# EAGLE design USB_PC (EAGLE 9.0.0)
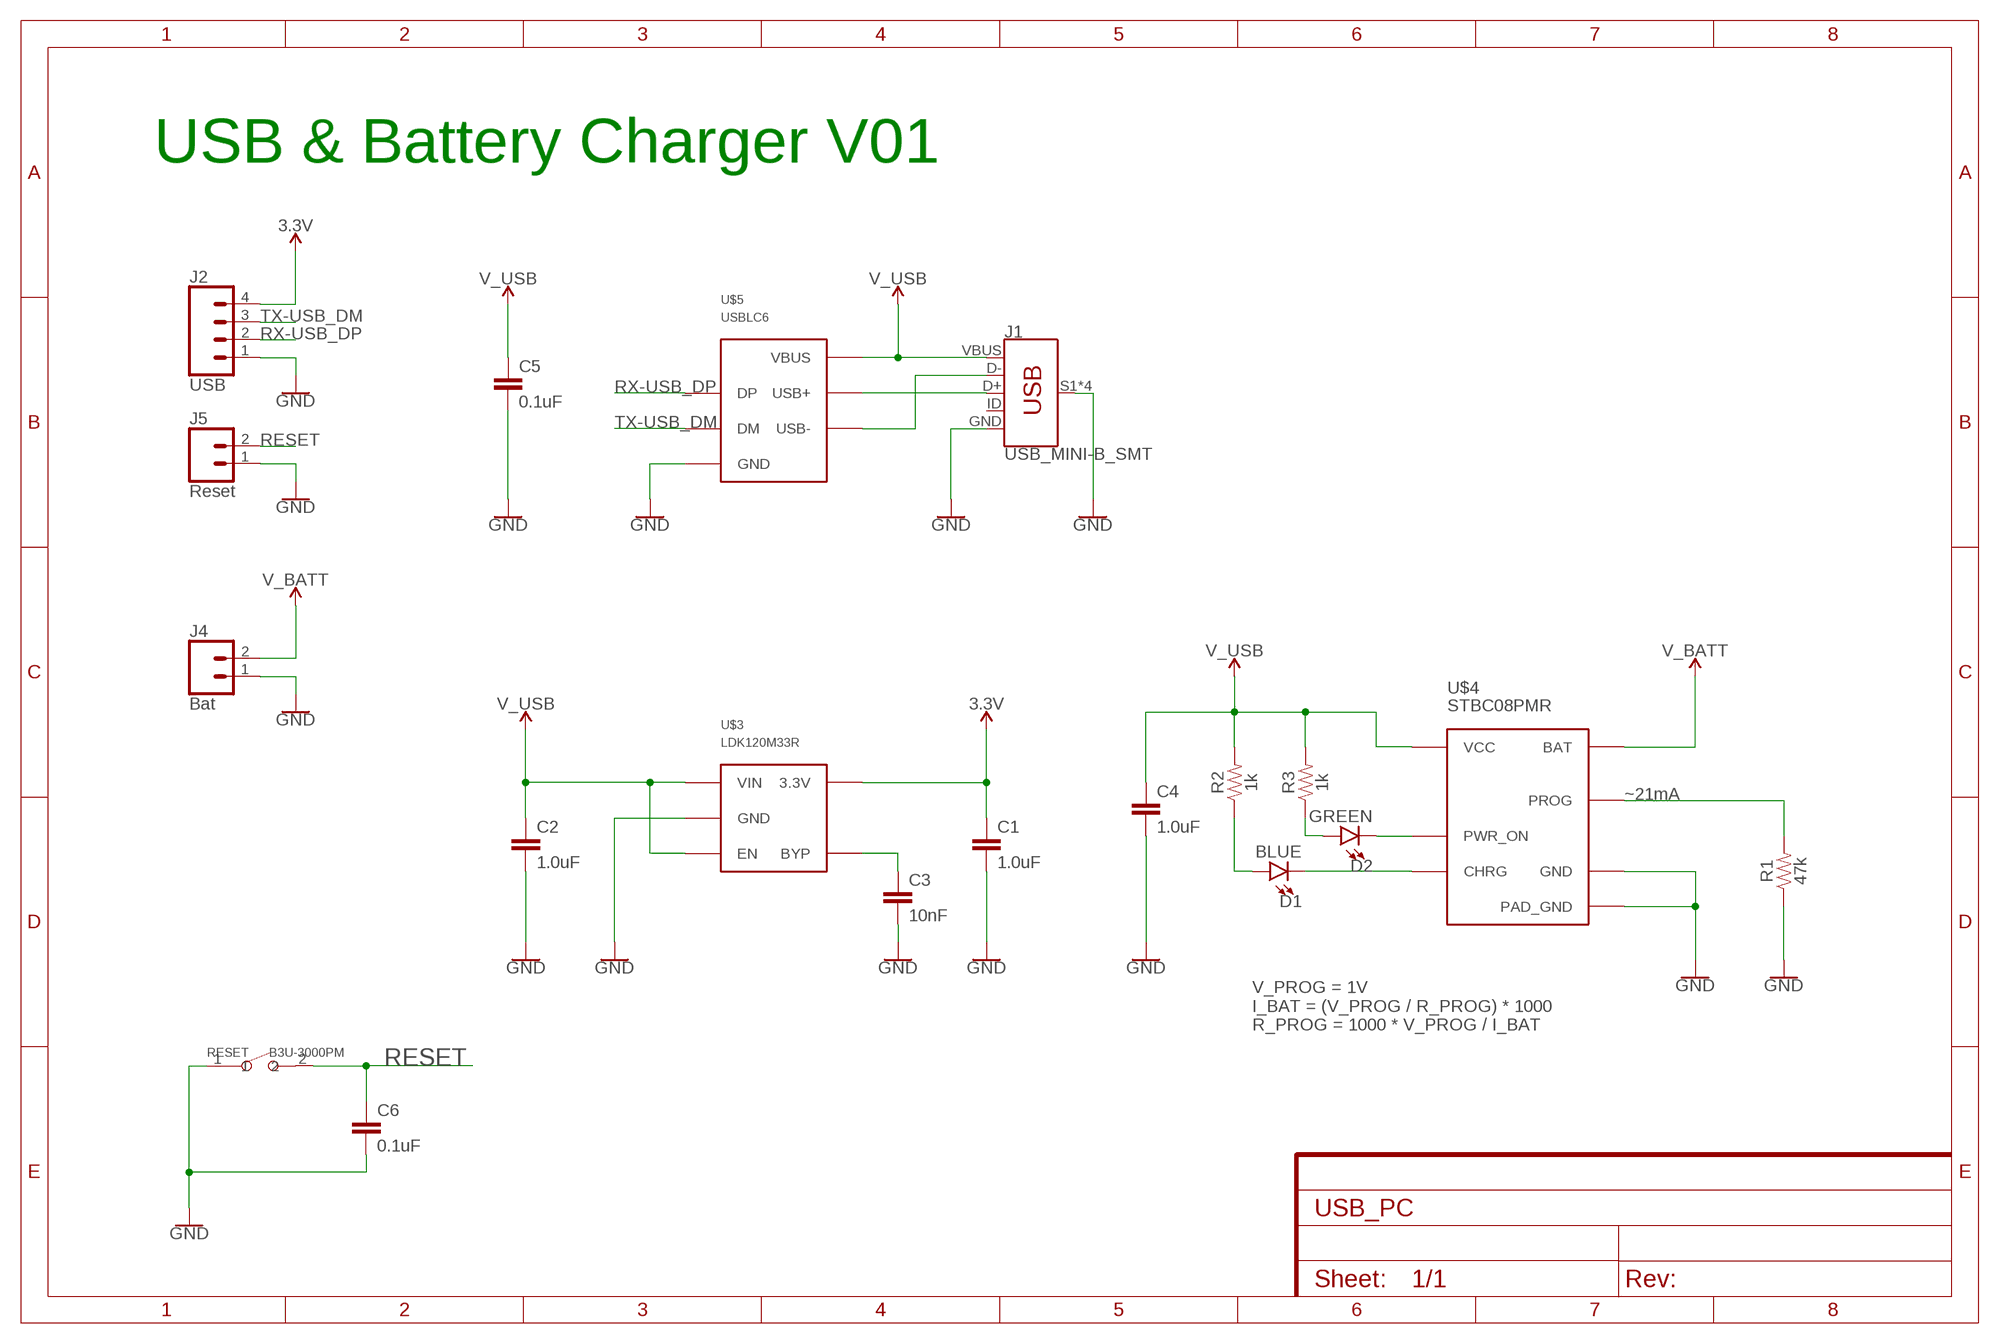
[diagram p0: schematic, sheet 1]

## Parts
C1  1.0uF  1.0UF-0603-16V-10%  [0603]
C2  1.0uF  1.0UF-0603-16V-10%  [0603]
C3  10nF  10NF-0603-50V-10%  [0603]
C4  1.0uF  1.0UF-0603-16V-10%  [0603]
C5  0.1uF  0.1UF-0603-25V-5%  [0603]
C6  0.1uF  0.1UF-0603-25V-5%  [0603]
D1  BLUE  LED-BLUE0603  [LED-0603]
D2  GREEN  LED-GREEN0603  [LED-0603]
J1  USB_MINI-B_SMT  [USB-MINIB]
J2  USB  CONN_04  [1X04]
J4  Bat  CONN_02JST-PTH-2  [JST-2-PTH]
J5  Reset  CONN_02  [1X02]
R1  47k  47KOHM-0603-1/10W-1%  [0603]
R2  1k  1KOHM-0603-1/10W-1%  [0603]
R3  1k  1KOHM-0603-1/10W-1%  [0603]
RESET  B3U-3000PM  SMD-BUTTON(2P-3.0X2.5X1.2+0.4MM)-B3U-1000P-2P-SMD  [SW2-2.6-3.0X2.5X1.2+0.4MM]
U$3  LDK120M33R  [SOT23-5]
U$4  STBC08PMR  [6-DFN(3X3)]
U$5  USBLC6  USBLC6-2SC6  [SOT23-6L]

## Nets
3.3V: C1.1 J2.4 U$3.3V3&5(3.3V)
GND: C1.2 C2.2 C3.2 C4.2 C5.2 C6.2 J1.GND J1.S1(SHIELD) J1.S2(SHIELD) J1.S3(SHIELD) J1.S4(SHIELD) J2.1 J4.1 J5.1 R1.1 RESET.1 U$3.GND$2(GND) U$4.GND$4(GND) U$4.PAD_GND$7(PAD_GND) U$5.GND$2(GND)
N$1: R1.2 U$4.PROG$5(PROG)
N$2: J1.D+ U$5.D+OUT$1$6(USB+)
N$3: J1.D- U$5.D-OUT$1$4(USB-)
N$4: D2.C U$4.ON$2(PWR_ON)
N$5: D1.C U$4.CHRG$3(CHRG)
N$6: C3.1 U$3.BYP$4(BYP)
N$7: D1.A R2.1
N$8: D2.A R3.1
RESET: C6.1 J5.2 RESET.2
RX-USB_DP: J2.2 U$5.D+IN$1(DP)
TX-USB_DM: J2.3 U$5.D-IN$3(DM)
V_BATT: J4.2 U$4.BAT$1(BAT)
V_USB: C2.1 C4.1 C5.1 J1.VBUS R2.2 R3.2 U$3.EN$3(EN) U$3.VIN$1(VIN) U$4.VCC$6(VCC) U$5.VUSB$5(VBUS)
Unconnected: J1.ID

## Notes on the sheet
- USB & Battery Charger V01
- ~21mA
- V_PROG = 1V
  I_BAT = (V_PROG / R_PROG) * 1000
  R_PROG = 1000 * V_PROG / I_BAT

## Library data of the parts
C1 C2 C4 = SparkFun-Capacitors:1.0UF: 1µF ceramic capacitors A capacitor is a passive two-terminal electrical component used to store electrical energy temporarily in an electric field.; PROD_ID: CAP-00868
C3 = SparkFun-Capacitors:10NF: 0.01uF/10nF/10,000pF ceramic capacitors A capacitor is a passive two-terminal electrical component used to store electrical energy temporarily in an electric field. CAP-09321; PROD_ID: CAP-00867
C5 C6 = SparkFun-Capacitors:0.1UF: 0.1µF ceramic capacitors A capacitor is a passive two-terminal electrical component used to store electrical energy temporarily in an electric field.; PROD_ID: CAP-08604
D1 = SparkFun-LED:LED-BLUE: Blue SMD LED Used in manufacturing of various products at SparkFun Packages: 0603 - SMD 0603 package [Product Link] <http://www.digikey.com/product-detail/en/SMLE12BC7TT86/511-1589-2-ND/1641808> 1206 - SMD1206 package [Product Link] <http://www.digikey.com/product-detail/en/lite-on-inc/LTST-C150TBKT/160-1643-1-ND/573584> SparkFun Products: ESP8266 Thing-Dev Board <https://www.sparkfun.com/products/13711> RedBoard <https://www.sparkfun.com/products/12757>; PROD_ID: DIO-08575
D2 = SparkFun-LED:LED-GREEN: Green SMD LED Used in manufacturing of various products at SparkFun Packages: 0603 - SMD 0603 package [Product Link] <http://www.futureelectronics.com/en/technologies/semiconductors/optoelectronics/leds/Pages/9894312-LTST-C190GKT.aspx?CrossPart=HSMG-C190&IM=0> LilyPad 1206 - SMD1206 LilyPad package [Product Link] <http://www.futureelectronics.com/en/Technologies/Product.aspx?ProductID=IN150NGHARVATEKCORPORATION2049943&IM=0> 1206 - SMD1206 package [Product Link] <http://www.futureelectronics.com/en/technologies/semiconductors/optoelectronics/leds/Pages/8315665-LTST-C150KGKT.aspx?IM=0> 1206 Bottom Mount -SMD 1206 Bottom Mount [Product Link] <http://www.digikey.com/product-detail/en/lite-on-inc/LTST-C230KGKT/160-1456-1-ND/386854> SparkFun Products: Pro Mini 328 -5V <https://www.sparkfun.com/products/821> RedBoard <https://www.sparkfun.com/products/12757> MP3 Trigger <https://www.sparkfun.com/products/13720> Makey Makey <https://www.sparkfun.com/products/11076>; PROD_ID: DIO-00821
J1 = SparkFun-Connectors:USB_MINI-B: USB type Mini-B Connector Breaks out 5th pin, and includes shield pins if needed. SparkFun Products: SparkFun FTDI Basic Breakout <https://www.sparkfun.com/products/9716> SparkFun XBee Explorer USB <https://www.sparkfun.com/products/11812> SparkFun Redboard <https://www.sparkfun.com/products/12757>; PROD_ID: CONN-08193; SF_ID: PRT-00587
J2 = SparkFun-Connectors:CONN_04: Multi connection point. Often used as Generic Header-pin footprint for 0.1 inch spaced/style header connections On any of the 0.1 inch spaced packages, you can populate with these: Break Away Headers - Straight <https://www.sparkfun.com/products/116> (PRT-00116) Break Away Male Headers - Right Angle <https://www.sparkfun.com/products/553> (PRT-00553) Female Headers <https://www.sparkfun.com/products/115> (PRT-00115) Break Away Headers - Machine Pin <https://www.sparkfun.com/products/117> (PRT-00117) Break Away Female Headers - Swiss Machine Pin <https://www.sparkfun.com/products/743> (PRT-00743) For SCREWTERMINALS and SPRING TERMINALS visit here: Screw Terimnals on SparkFun.com <https://www.sparkfun.com/search/results?term=Screw+Terminals> (5mm/3.5mm/2.54mm spacing) This device is also useful as a general connection point to wire up your design to another part of your project. Our various solder wires solder well into these plated through hole pads. Hook-Up Wire - Assortment (Stranded, 22 AWG) <https://www.sparkfun.com/products/11375> (PRT-11375) Hook-Up Wire - Assortment (Solid Core, 22 AWG) <https://www.sparkfun.com/products/11367> (PRT-11367) View the entire wire category on our website here <https://www.sparkfun.com/categories/141> Special notes: Molex polarized connector foot print use with SKU : PRT-08231 with associated crimp pins and housings. 1MM SMD Version SKU: PRT-10208; PROD_ID: CONN-09696
J4 = SparkFun-Connectors:CONN_02: Multi connection point. Often used as Generic Header-pin footprint for 0.1 inch spaced/style header connections On any of the 0.1 inch spaced packages, you can populate with these: Break Away Headers - Straight <https://www.sparkfun.com/products/116> (PRT-00116) Break Away Male Headers - Right Angle <https://www.sparkfun.com/products/553> (PRT-00553) Female Headers <https://www.sparkfun.com/products/115> (PRT-00115) Break Away Headers - Machine Pin <https://www.sparkfun.com/products/117> (PRT-00117) Break Away Female Headers - Swiss Machine Pin <https://www.sparkfun.com/products/743> (PRT-00743) For SCREWTERMINALS and SPRING TERMINALS visit here: Screw Terimnals on SparkFun.com <https://www.sparkfun.com/search/results?term=Screw+Terminals> (5mm/3.5mm/2.54mm spacing) This device is also useful as a general connection point to wire up your design to another part of your project. Our various solder wires solder well into these plated through hole pads. Hook-Up Wire - Assortment (Stranded, 22 AWG) <https://www.sparkfun.com/products/11375> (PRT-11375) Hook-Up Wire - Assortment (Solid Core, 22 AWG) <https://www.sparkfun.com/products/11367> (PRT-11367) View the entire wire category on our website here <https://www.sparkfun.com/categories/141> Special notes: Molex polarized connector foot print use with: PRT-08233 with associated crimp pins and housings. 2.54_SCREWTERM for use with PRT-10571. 3.5mm Screw Terminal footprints for PRT-08084 5mm Screw Terminal footprints for use with PRT-08432; PROD_ID: CONN-09863; SKU: PRT-09914
J5 = SparkFun-Connectors:CONN_02: Multi connection point. Often used as Generic Header-pin footprint for 0.1 inch spaced/style header connections On any of the 0.1 inch spaced packages, you can populate with these: Break Away Headers - Straight <https://www.sparkfun.com/products/116> (PRT-00116) Break Away Male Headers - Right Angle <https://www.sparkfun.com/products/553> (PRT-00553) Female Headers <https://www.sparkfun.com/products/115> (PRT-00115) Break Away Headers - Machine Pin <https://www.sparkfun.com/products/117> (PRT-00117) Break Away Female Headers - Swiss Machine Pin <https://www.sparkfun.com/products/743> (PRT-00743) For SCREWTERMINALS and SPRING TERMINALS visit here: Screw Terimnals on SparkFun.com <https://www.sparkfun.com/search/results?term=Screw+Terminals> (5mm/3.5mm/2.54mm spacing) This device is also useful as a general connection point to wire up your design to another part of your project. Our various solder wires solder well into these plated through hole pads. Hook-Up Wire - Assortment (Stranded, 22 AWG) <https://www.sparkfun.com/products/11375> (PRT-11375) Hook-Up Wire - Assortment (Solid Core, 22 AWG) <https://www.sparkfun.com/products/11367> (PRT-11367) View the entire wire category on our website here <https://www.sparkfun.com/categories/141> Special notes: Molex polarized connector foot print use with: PRT-08233 with associated crimp pins and housings. 2.54_SCREWTERM for use with PRT-10571. 3.5mm Screw Terminal footprints for PRT-08084 5mm Screw Terminal footprints for use with PRT-08432
R1 = SparkFun-Resistors:47KOHM: 47kΩ resistor A resistor is a passive two-terminal electrical component that implements electrical resistance as a circuit element. Resistors act to reduce current flow, and, at the same time, act to lower voltage levels within circuits. - Wikipedia; PROD_ID: RES-07871
R2 R3 = SparkFun-Resistors:1KOHM: 1kΩ resistor A resistor is a passive two-terminal electrical component that implements electrical resistance as a circuit element. Resistors act to reduce current flow, and, at the same time, act to lower voltage levels within circuits. - Wikipedia; PROD_ID: RES-07856
RESET = Seeed-Switch-2016:SMD-BUTTON(2P-3.0X2.5X1.2+0.4MM): 311020047; MPN: B3U-1000P-2P-SMD; VALUE: B3U-1000P-2P-SMD
U$3 = LDK120M33R:LDK120M33R: TLV733P Capacitor-Free, 300-mA, Low-Dropout Regulator
U$4 = STBC08PMR:STBC08PMR: STBC08PMR Digikey: 497-5808-1-ND
U$5 = USBLC6-2SC6:USBLC6-2SC6: USBLC6-2SC6 Digikey: 497-5235-1-ND

## Board
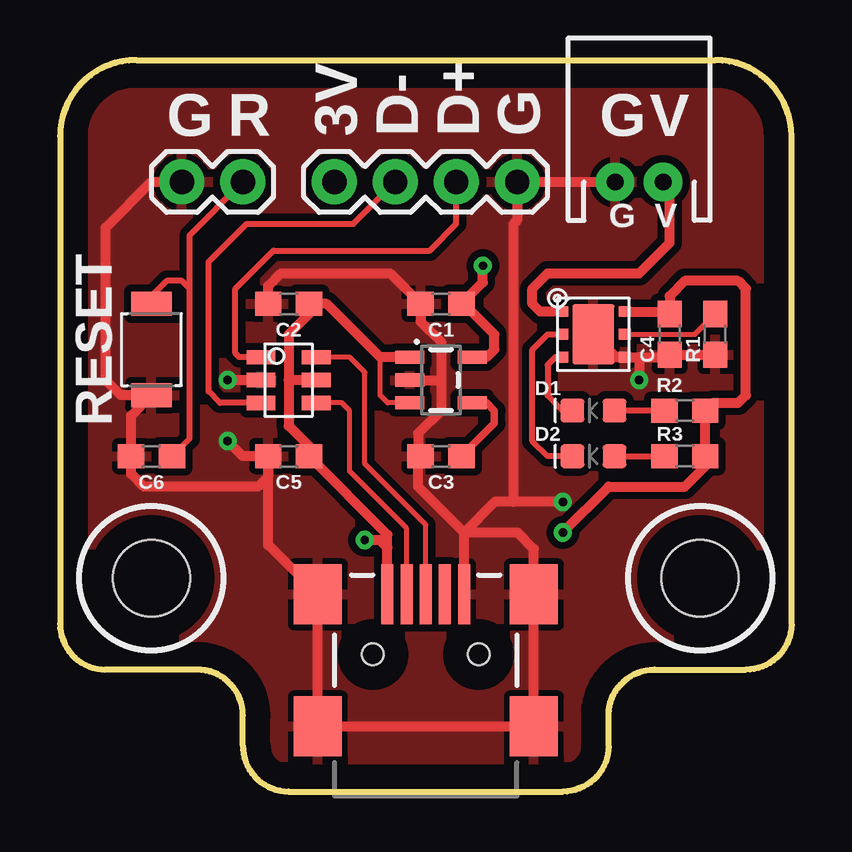
[diagram p1: board, top side]
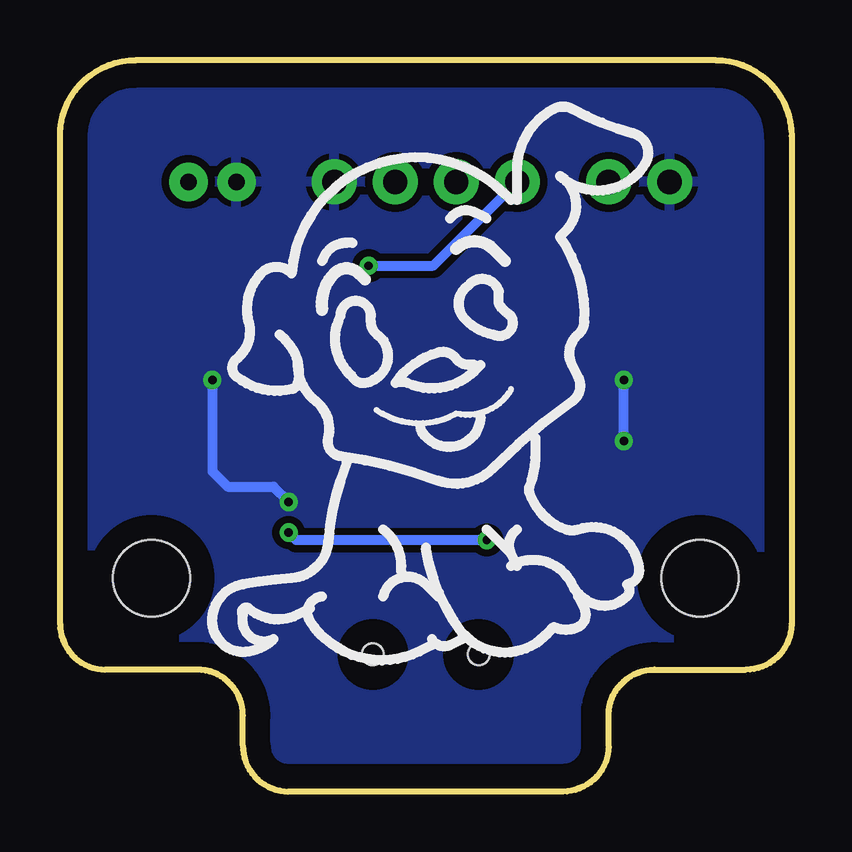
[diagram p2: board, bottom side, seen from below]

Size 30.48 x 30.48 mm. Coordinates in mm from the lower left corner, seen from the top.
Outline: 9.53,0 20.95,0 arc90 22.86,1.91 22.86,3.17 arc-90 24.77,5.08 28.57,5.08 arc90 30.48,6.99 30.48,27.3 arc90 27.3,30.48 3.17,30.48 arc90 0,27.3 0,6.99 arc90 1.91,5.08 5.71,5.08 arc-90 7.62,3.17 7.62,1.91 arc90 9.53,0
Copper layers (1*16): Top 0.035mm / dielectric 1.5mm / Bottom 0.035mm
Design rules "default *": minimum track width 6mil, minimum drill 0.35mm, track to track 6mil, track to pad 6mil, pad to pad 6mil, via to via 6mil, smd to smd 6mil, copper to edge 40mil, drill to drill 6mil, minimum pad ring 10mil, minimum via ring 8mil, stop-mask expansion 4mil, vias tented up to drill 20mil, thermal gap 10mil
Holes 3.2 mm at 26.67,8.89 3.81,8.89

### Footprints (pad centres in the part's own frame; a part is rotated, then mirrored left to right if it is on the bottom)
0603 = smd 1.1 x 1: 1 -0.85,0; 2 0.85,0
LED-0603 = smd 1 x 1: A -0.877,0; C 0.877,0
USB-MINIB = smd 2.5 x 0.5: D+ 2.5,0; D- 2.5,0.8; GND 2.5,-1.6; ID 2.5,-0.8; VBUS 2.5,1.6 | smd 2.5 x 2: S1 -3,4.5; S2 2.5,4.5; S3 -3,-4.5; S4 2.5,-4.5 | hole 0.9: 0,2.2; 0,-2.2
1X04 = drill 1.016 pad 1.88: 1 0,0; 2 2.54,0; 3 5.08,0; 4 7.62,0
JST-2-PTH = drill 0.7 pad 1.6: 1 -1,0; 2 1,0
1X02 = drill 1.016 pad 1.88: 1 0,0; 2 2.54,0
SW2-2.6-3.0X2.5X1.2+0.4MM = smd 1 x 1.7: 1 -1.9,0; 2 1.9,0
SOT23-5 = smd 0.55 x 1.2: 3V3&5 -0.95,1.3; BYP$4 0.95,1.3; EN$3 0.95,-1.3; GND$2 0,-1.3; VIN$1 -0.95,-1.3
6-DFN(3X3) = smd 0.45 x 0.5: BAT$1 -0.95,-1.3; CHRG$3 0.95,-1.3; GND$4 0.95,1.3; ON$2 0,-1.3; PROG$5 0,1.3; VCC$6 -0.95,1.3 | smd 2.5 x 1.75: PAD_GND$7 0,0
SOT23-6L = smd 0.6 x 1.2: D+IN$1 -0.95,-1.15; D+OUT$1$6 -0.95,1.15; D-IN$3 0.95,-1.15; D-OUT$1$4 0.95,1.15; GND$2 0,-1.15; VUSB$5 0,1.15

### Placement (x,y rotation side)
C1  15.88,20.32 180 top
C2  9.53,20.32 180 top
C3  15.88,13.97 180 top
C4  25.4,19.05 270 top
C5  9.53,13.97 180 top
C6  3.81,13.97 180 top
D1  22.23,15.88 180 top
D2  22.23,13.97 180 top
J1  15.24,5.71 90 top
J2  19.05,25.4 180 top
J4  24.13,25.4 0 top
J5  5.08,25.4 0 top
R1  27.3,19.05 90 top
R2  26.04,15.88 0 top
R3  26.04,13.97 0 top
RESET  3.81,18.41 90 top
U$3  15.88,17.14 270 top
U$4  22.23,19.05 270 top
U$5  9.53,17.14 270 top

### Tracks (layer width: path | path; a pad name or v marks a point on that pad's centre or on a via)
3.3V  (via drill 0.35)
  Top 0.406: U$3.3V3&5 17.78,18.1 18.1,18.41 18.1,19.05 16.83,20.32 C1.1 17.62,21.22 v17.62,21.91
  Bottom 0.406: v17.62,21.91 14.92,21.91 J2.4
GND  (via drill 0.35)
  Top 0.406: J1.GND 16.84,10.78 | 16.84,10.78 14.92,12.7 14.92,13.87 14.92,14.92 15.88,15.88 15.88,17.14 | 15.88,17.14 15.88,18.73 15.03,19.58 C1.2 13.76,21.59 9.21,21.59 8.68,21.06 C2.2 | U$3.GND$2 15.88,17.14 | U$5.GND$2 v6.99,17.14 | C5.2 7.62,13.97 v6.99,14.61 | C5.2 8.68,13.12 8.26,12.7 3.49,12.7 2.96,13.23 C6.2 2.96,15.66 RESET.1 2.54,16.52 1.91,17.14 1.91,23.5 3.81,25.4 J5.1 | C5.2 8.68,10.28 J1.S2 J1.S1 J1.S3 J1.S4 19.74,10.11 19.06,10.78 16.84,10.78 | U$4.PAD_GND$7 23.18,18.1 U$4.GND$4 24.13,18.1 | 24.13,18.1 25.3,18.1 C4.2 R1.1 | 24.13,18.1 v24.13,17.14 | v20.95,12.06 18.89,12.06 | 18.89,12.06 18.12,12.06 16.84,10.78 | J4.1 J2.1 19.05,23.81 18.89,23.65 18.89,12.06
  Top 0.508: 14.92,13.87 C3.2
  Bottom 0.406: v6.99,14.61 v6.99,17.14 | v24.13,17.14 24.13,13.34 23.5,12.7 21.59,12.7 v20.95,12.06
  pour Bottom (isolate 0.305): 0,0 30.48,0 30.48,30.48 0,30.48
  pour Top (isolate 0.305): 0,0 30.48,0 30.48,30.48 0,30.48
N$1
  Top 0.203: U$4.PROG$5 26.45,19.05 R1.2
N$2
  Top 0.203: J1.D+ 15.24,11.11 12.7,13.65 12.7,17.46 12.06,18.1 12.06,18.09 U$5.D+OUT$1$6
N$3
  Top 0.203: J1.D- 14.44,10.96 12.06,13.34 12.06,15.88 11.74,16.2 U$5.D-OUT$1$4
N$4
  Top 0.254: D2.C 20.32,13.97 19.68,14.61 19.68,18.41 20.32,19.05 U$4.ON$2
N$5
  Top 0.254: U$4.CHRG$3 20.64,18.1 20.32,17.78 20.32,16.51 20.95,15.88 D1.C
N$6
  Top 0.305: C3.1 18.1,15.34 18.1,15.88 17.78,16.2 U$3.BYP$4
N$7
  Top 0.254: R2.1 D1.A
N$8
  Top 0.254: D2.A R3.1
RESET
  Top 0.254: C6.1 5.4,14.71 5.4,20.95 | 5.4,20.95 5.08,21.27 4.45,21.27 3.81,20.64 RESET.2 | 5.4,20.95 5.4,23.18 J5.2
RX-USB_DP
  Top 0.254: U$5.D+IN$1 7.46,18.09 7.3,18.26 7.3,20.95 8.89,22.54 15.4,22.54 16.51,23.65 J2.2
TX-USB_DM
  Top 0.254: U$5.D-IN$3 6.67,16.2 6.19,16.67 6.19,22.07 7.78,23.65 12.22,23.65 J2.3
V_BATT
  Top 0.406: U$4.BAT$1 20,20 19.68,20.32 19.68,20.95 20.32,21.59 24.13,21.59 25.4,22.86 25.4,25.13 J4.2
V_USB  (via drill 0.35)
  Top 0.203: U$3.EN$3 13.65,16.2 13.34,16.51 13.34,18.1
  Top 0.254: R2.2 27.2,16.19
  Top 0.406: J1.VBUS 13.64,10.16 | 13.64,10.16 13.64,10.71 C5.1 10.38,14.39 9.53,15.24 9.53,17.14 | 9.53,17.14 9.53,19.05 10.38,19.9 C2.1 11.11,20.32 13.34,18.1 U$3.VIN$1 | U$5.VUSB$5 9.53,17.14 | U$4.VCC$6 25.3,20 C4.1 25.4,20.64 26.04,21.27 28.26,21.27 28.57,20.95 28.57,16.51 28.26,16.19 27.2,16.19 | R2.2 R3.2 26.89,13.55 26.04,12.7 22.86,12.7 v20.95,10.79 | 13.64,10.16 13.32,10.48 v12.7,10.48
  Bottom 0.406: v12.7,10.48 20.64,10.48 v20.95,10.79

### Text on the board
tPlace: G | R | 3V | D- | D+ | G | G | V | G | V
200bmp: C:/WorkSpace/Eagle_WorkSpace/TrackIt/SensorTile_Adapter/PC_USB_V01/Doggy.bmp